# Altium schematic sheet 555手风琴.SchDoc
size A4; SheetNumber: 1; SheetTotal: 1
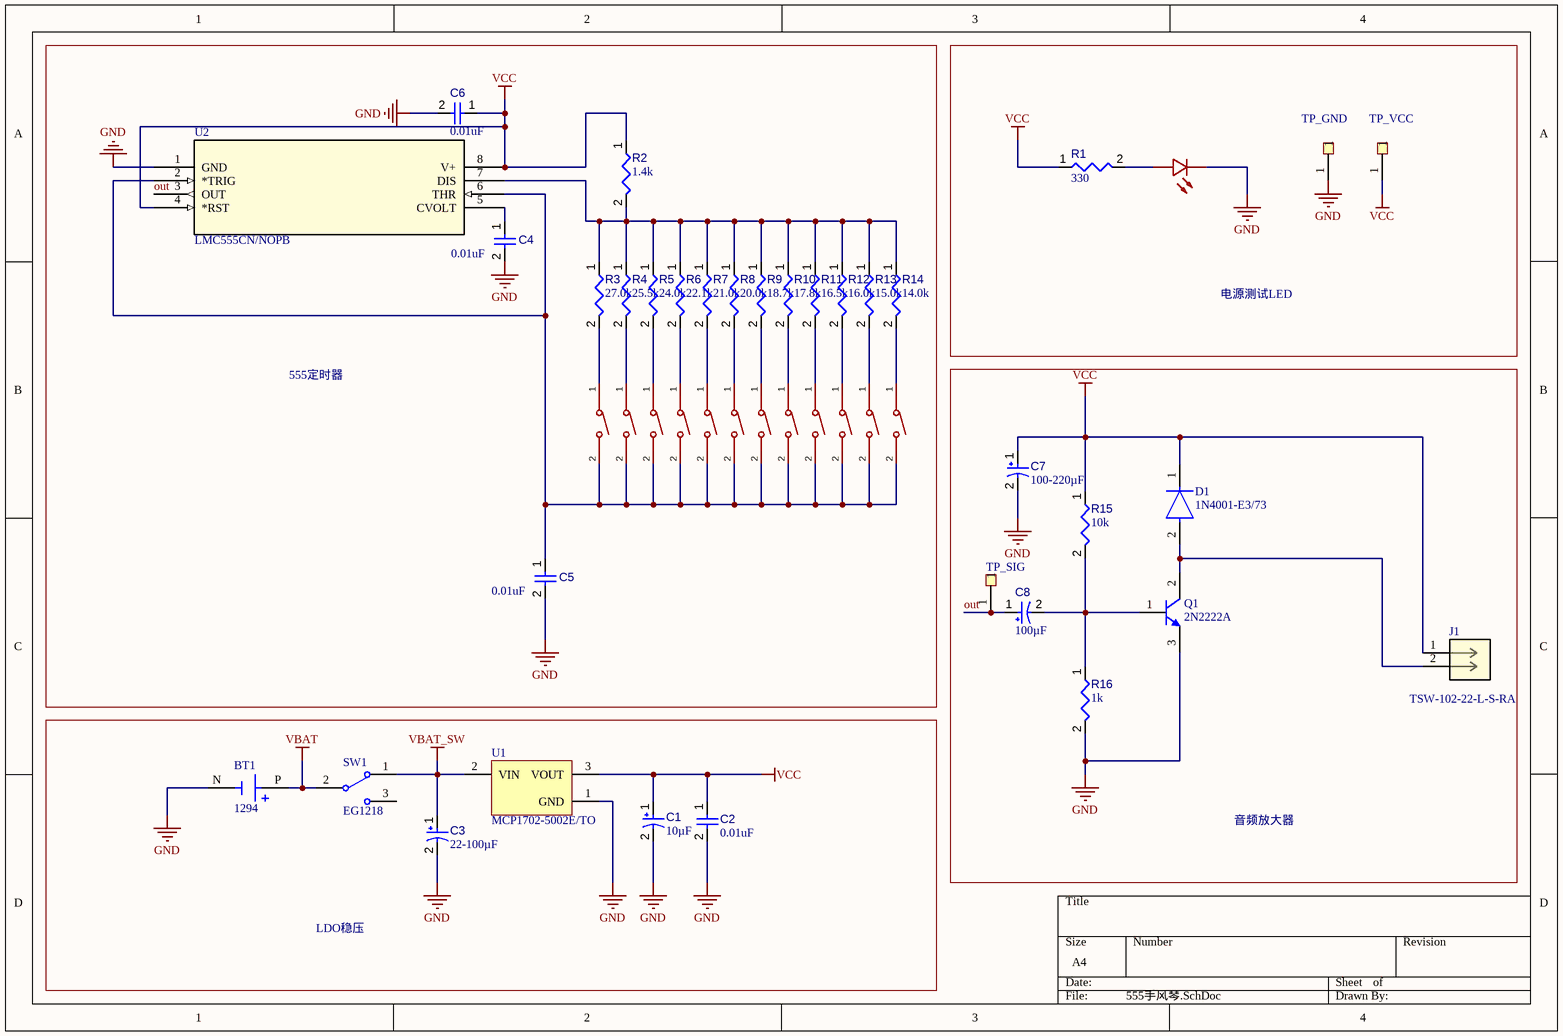
[diagram p0: 555手风琴.SchDoc]

## Parts
BT1  1294  [BAT_1294]
C1  value 10µF  [CAPMP3217X18-T_V]  (hidden comment: TAJA106K016RNJ)
C2  value 0.01uF  [CAPC2013X95X50LL10T25]  (hidden comment: Capacitor 100 nF +/-10% 50 V 0805)
C3  value 22-100µF  [CAPMP3217X18-T_V]  (hidden comment: TAJA106K016RNJ)
C4  value 0.01uF  [CAPC2013X95X50LL10T25]  (hidden comment: Capacitor 100 nF +/-10% 50 V 0805)
C5  value 0.01uF  [CAPC2013X95X50LL10T25]  (hidden comment: Capacitor 100 nF +/-10% 50 V 0805)
C6  value 0.01uF  [CAPC2013X95X50LL10T25]  (hidden comment: Capacitor 100 nF +/-10% 50 V 0805)
C7  value 100-220µF  [CAPMP3217X18-T_V]  (hidden comment: TAJA106K016RNJ)
C8  value 100µF  [CAPMP3217X18-T_V]  (hidden comment: TAJA106K016RNJ)
D1  1N4001-E3/73  [FP-1N4001-E3-73-MFG]
J1  TSW-102-22-L-S-RA  [CON2_1X2_TR_TSW_SAI]
LED1  FC-DA1608HRK-620D  [LED0603-RD_RED]  (value not drawn)
Q1  2N2222A  [STM-TO-18-3]
R1  value 330  [RESC0402(1005)_L]  (hidden comment: 100R2F)
R2  value 1.4k  [RESC0402(1005)_L]  (hidden comment: 100R2F)
R3  value 27.0k  [RESC0402(1005)_L]  (hidden comment: 100R2F)
R4  value 25.5k  [RESC0402(1005)_L]  (hidden comment: 100R2F)
R5  value 24.0k  [RESC0402(1005)_L]  (hidden comment: 100R2F)
R6  value 22.1k  [RESC0402(1005)_L]  (hidden comment: 100R2F)
R7  value 21.0k  [RESC0402(1005)_L]  (hidden comment: 100R2F)
R8  value 20.0k  [RESC0402(1005)_L]  (hidden comment: 100R2F)
R9  value 18.7k  [RESC0402(1005)_L]  (hidden comment: 100R2F)
R10  value 17.8k  [RESC0402(1005)_L]  (hidden comment: 100R2F)
R11  value 16.5k  [RESC0402(1005)_L]  (hidden comment: 100R2F)
R12  value 16.0k  [RESC0402(1005)_L]  (hidden comment: 100R2F)
R13  value 15.0k  [RESC0402(1005)_L]  (hidden comment: 100R2F)
R14  value 14.0k  [RESC0402(1005)_L]  (hidden comment: 100R2F)
R15  value 10k  [RESC0402(1005)_L]  (hidden comment: 100R2F)
R16  value 1k  [RESC0402(1005)_L]  (hidden comment: 100R2F)
SW1  EG1218  [ESWI-EG1218_V]
SW2  TS-1088-AR02016  [SW-SMD_L3.9-W3.0-P4.45]  (value not drawn)
SW3  TS-1088-AR02016  [SW-SMD_L3.9-W3.0-P4.45]  (value not drawn)
SW4  TS-1088-AR02016  [SW-SMD_L3.9-W3.0-P4.45]  (value not drawn)
SW5  TS-1088-AR02016  [SW-SMD_L3.9-W3.0-P4.45]  (value not drawn)
SW6  TS-1088-AR02016  [SW-SMD_L3.9-W3.0-P4.45]  (value not drawn)
SW7  TS-1088-AR02016  [SW-SMD_L3.9-W3.0-P4.45]  (value not drawn)
SW8  TS-1088-AR02016  [SW-SMD_L3.9-W3.0-P4.45]  (value not drawn)
SW9  TS-1088-AR02016  [SW-SMD_L3.9-W3.0-P4.45]  (value not drawn)
SW10  TS-1088-AR02016  [SW-SMD_L3.9-W3.0-P4.45]  (value not drawn)
SW11  TS-1088-AR02016  [SW-SMD_L3.9-W3.0-P4.45]  (value not drawn)
SW12  TS-1088-AR02016  [SW-SMD_L3.9-W3.0-P4.45]  (value not drawn)
SW13  TS-1088-AR02016  [SW-SMD_L3.9-W3.0-P4.45]  (value not drawn)
TP_GND  Component_1  [PCBComponent_1]  (value not drawn)
TP_SIG  Component_1  [PCBComponent_1]  (value not drawn)
TP_VCC  Component_1  [PCBComponent_1]  (value not drawn)
U1  MCP1702-5002E/TO  [TO-92-TO3]
U2  LMC555CN/NOPB  [N08E_TEX]

## Blocks framed on the sheet
555定时器: C4-C6 R2-R14 SW2-SW13 U2
电源测试LED: LED1 R1 TP_GND TP_VCC
音频放大器: C7 C8 D1 J1 Q1 R15 R16 TP_SIG
LDO稳压: BT1 C1-C3 SW1 U1

## Nets
GND: BT1.N(NEG) C1.2 C2.2 C3.2 C4.2 C5.2 C6.2 C7.2 LED1.1(K) Q1.3(E) R16.2 TP_GND.1 U1.1(GND) U2.1(GND)
VBAT: BT1.P(POS) SW1.2(COM)
VBAT_SW: C3.1 SW1.1 U1.2(VIN)
VCC: C1.1 C2.1 C6.1 C7.1 D1.1(C) J1.1 R1.1 R2.1 R15.1 TP_VCC.1 U1.3(VOUT) U2.4(*RST) U2.8(V+)
out: C8.1 TP_SIG.1 U2.3(OUT)
NetC4_1: C4.1 U2.5(CVOLT)
NetC5_1: C5.1 SW2.2 SW3.2 SW4.2 SW5.2 SW6.2 SW7.2 SW8.2 SW9.2 SW10.2 SW11.2 SW12.2 SW13.2 U2.2(*TRIG) U2.6(THR)
NetC8_2: C8.2 Q1.1(B) R15.2 R16.1
NetD1_2: D1.2(A) J1.2 Q1.2(C)
NetLED1_2: LED1.2(A) R1.2
NetR2_2: R2.2 R3.1 R4.1 R5.1 R6.1 R7.1 R8.1 R9.1 R10.1 R11.1 R12.1 R13.1 R14.1 U2.7(DIS)
NetR3_2: R3.2 SW2.1
NetR4_2: R4.2 SW3.1
NetR5_2: R5.2 SW4.1
NetR6_2: R6.2 SW5.1
NetR7_2: R7.2 SW6.1
NetR8_2: R8.2 SW7.1
NetR9_2: R9.2 SW8.1
NetR10_2: R10.2 SW9.1
NetR11_2: R11.2 SW10.1
NetR12_2: R12.2 SW11.1
NetR13_2: R13.2 SW12.1
NetR14_2: R14.2 SW13.1

Not connected (* = marked no-connect by the designer): SW1 3

## Library data of the parts
BT1 = 1294: 9 Volt Battery Holder- PC Terminals; MF: Keystone Electronics; SnapEDA_Link: https://www.snapeda.com/parts/1294/Keystone/view-part/?ref=snap; Package: NON STANDARD-6 Keystone; Value: *; MP: 1294; Check_prices: https://www.snapeda.com/parts/1294/Keystone/view-part/?ref=eda
C1 C3 C7 C8 = CMP-001-00041-7: Standard Tantalum, 10 uF, +/- 10%, 16 V, -55 to 125 degC, 1206 (3216 Metric), RoHS, Tape and Reel; Manufacturer: AVX; Voltage Rating: 16V; ESR: 3Ohm; Datasheet URL: http://datasheets.avx.com/TAJ.pdf; Package URL: http://www.avx.com/download/software/literature/AVX-Footprint-Library.pdf; Pins: 2; Package Reference: CAPMP3217X18-T; RoHS Compliant: True; Case/Package: 1206; Max Operating Temperature: 125°C; Package Description: 2-Pin Surface Mount Device, Body 3.2 x 1.65 mm; Mounting Technology: SM; Tolerance: 10%; Package Quantity: 1; Packaging: TapeandReel; Min Operating Temperature: -55°C; Datasheet Version: Feb-16; Manufacturer URL: http://www.avx.com/; Capacitor Type: Tantalum
C2 C4-C6 = CMP-001-00018-6: Chip Capacitor, 100 nF, +/- 10%, 50 V, 0805 (2012 Metric); Capacitor Type: Ceramic; Voltage Rating: 50V; Pins: 2; Max Operating Temperature: 125°C; Min Operating Temperature: -55°C; Mounting Technology: SM; Case/Package: 0805; RoHS Compliant: True; Tolerance: 10%
D1 = CMP-02540-000001-1: DIODE GEN PURP 50V 1A DO204AL; Manufacturer: Vishay; Max Surge Forward Current: 30A; Value: 15pF; Peak Reverse Current: 5uA; Max Junction Temp: +150°C; Lead Free: Yes; Manufacturer Part Number: 1N4001-E3/73; Height: 2.7mm; Digikey Description: DIODE GEN PURP 50V 1A DO204AL; Reverse Voltage: 50V; Package: 1N4001-E3/73; RoHS: TRUE; Temperature: -50°C to +150°C; Device Class L2: Diodes; Forward Current: 1A; Max Repetitive Reverse Voltage: 50V; Device Class L1: Discrete Semiconductors; Device Class L3: Rectifier Diodes; Capacitance: 15pF; Temperature Range High: +150°C; Category: Diode; Ipc Land Pattern Name: DIOPA1088W105L520D270; ComponentLink2URL: http://www.vishay.com/docs/88503/1n4001.pdf; Octopart: https://octopart.com/1n4001-e3%2F73-vishay-42330130; Automotive: No; ComponentLink2Description: Datasheet; Temperature Range Low: -50°C; Mouser Description: Rectifiers Vr/50V Io/1A
J1 = TSW-102-22-L-S-RA: No Description Available; Manufacturer_Name: Samtec Inc; Copyright: Copyright (C) 2026 Ultra Librarian. All rights reserved.; Manufacturer_Part_Number: TSW-102-22-L-S-RA; RefDes: RefDes; Type: Type
Q1 = CMP-2000-05381-1: High Speed Switch, 0.6 A IC, -65 to 175 degC, 3-Pin TO-18, RoHS, Bulk; Manufacturer: STMicroelectronics; Power Dissipation Pd: 500mW; DC Current Gain hFE: 300hFE; Transistor Polarity: NPN; DC Collector Current: 600mA; No. of Pins: 3Pins; Transition Frequency ft: 300MHz; Collector Emitter Voltage V(br)ceo: 40V; Product Range: -; Package Reference: TO-18-3; Datasheet URL: https://datasheet.ciiva.com/25917/cd00003223-25917094.pdf; Automotive Qualification Standard: -; Transistor Case Style: TO-18; Operating Temperature Max: 175degC; Datasheet Version: Feb-03; Package Description: 3-Pin Through Hole Device, Dia 5.8 mm, Pitch 1.27 mm; Manufacturer URL: http://www.st.com/
R1-R16 = CMP-009-00065-2: 100R 0.063W 1% 0402 (1005 Metric)  SMD; Power: 63mW; Tolerance: 1%; Case/Package: 0402; Pins: 2; Mounting Technology: SMT
SW1 = CMP-1696-00002-1: Slide Switch, 500 V, -20 to 70 degC, 3-Pin THD, RoHS; Case\Package: SOT-23-5; Output Current: 150 mA; Nominal Output Voltage: 3.3 V; Max Power Dissipation: 250 mW; Min Input Voltage: 4.3 V; Outputs: 1; Max Input Voltage: 8 V; Dropout Voltage: 300 mV; PackageDescription: 3-Pin Through Hole Device, Body 11.6 x 4 mm, Pitch 2.5 mm; ComponentLink1URL: http://www.e-switch.ch/en/; RoHSCompliant: true; Length: 3 mm; ComponentLink1Description: Manufacturer URL; Power Rating: 250 mW; Mount: Surface Mount; Max Operating Temperature: 85 degC; REACH SVHC: No SVHC; Radiation Hardening: No; Height: 1.3 mm; Pins: 5; Max Ouput Current: 150 mA; Output Voltage: 3.3 V; Width: 1.8 mm; Package Quantity: 3000; ComponentLink2URL: https://www.e-switch.com/system/asset/product_line/data_sheet/119/EG.pdf; Min Operating Temperature: -40 degC; ComponentLink2Description: Datasheet; DatasheetVersion: Oct-15; PackageReference: EG1218; Packaging: Tape and Reel
U1 = CMP-0136-00022-1: 250 mA Low Quiescent Current LDO Regulator, 3-Pin TO-92, Extended TemperatureBAG; PackageVersion: revBB, Aug-2009; PackageReference: TO-92-TO3; PackageDescription: 3-Lead Plastic Transistor Outline (TO) [TO-92]; DatasheetVersion: revD, Jun-2009
U2 = LMC555CNNOPB: Worldâ€™s smallest 555 timer with low power, high accuracy and a Fmax of 3MHz 8-PDIP -40 to 85; Manufacturer_Name: Texas Instruments; Copyright: Copyright (C) 2025 Ultra Librarian. All rights reserved.; Manufacturer_Part_Number: LMC555CN/NOPB; RefDes: RefDes; Type: Type
LED1 = FC-DA1608HRK-620D: Symbol: FC-DA1608HRK-620D
SW2-SW13 = TS-1088-AR02016: Symbol: TS-1088-AR02016